# EAGLE design UserInterface_RevA (EAGLE 7.6.0)

## Sheet 1 of 2
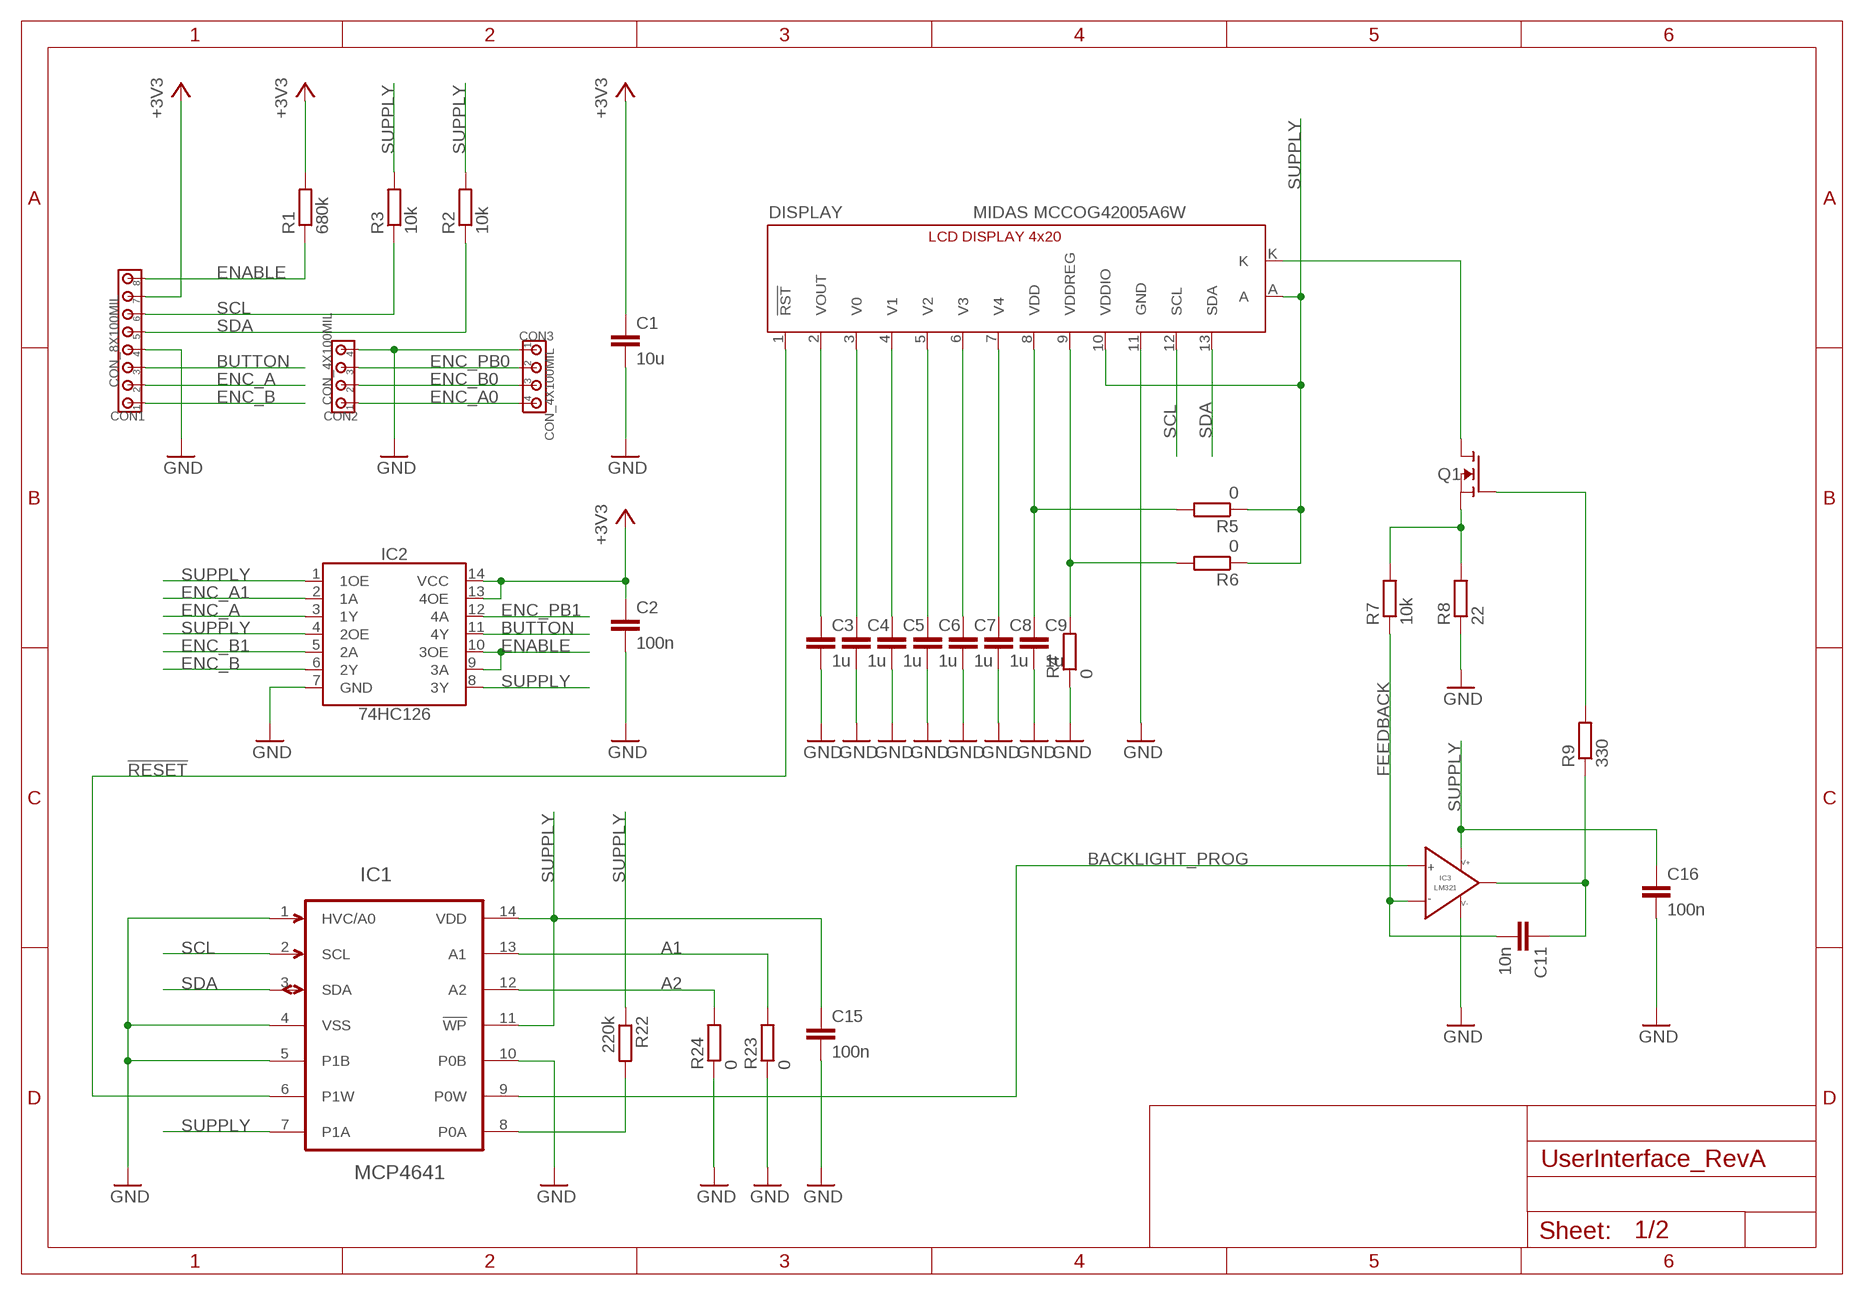
[diagram p0: schematic, sheet 1]

### Parts
C1  10u  CC0805  [C0805]
C2  100n  CC0805  [C0805]
C3  1u  CC0805  [C0805]
C4  1u  CC0805  [C0805]
C5  1u  CC0805  [C0805]
C6  1u  CC0805  [C0805]
C7  1u  CC0805  [C0805]
C8  1u  CC0805  [C0805]
C9  1u  CC0805  [C0805]
C11  10n  CC0805  [C0805]
C15  100n  CC0805  [C0805]
C16  100n  CC0805  [C0805]
CON1  CON_8X100MIL  [100MIL_8X]
CON2  CON_4X100MIL  [100MIL_4X]
CON3  CON_4X100MIL  [100MIL_4X]
DISPLAY  MIDAS MCCOG42005A6W  LCD4X20_I2C  [LCD_4X20_I2C]
IC1  MCP4641  [TSSOP14]
IC2  74HC126  [SO14]
IC3  LM321  [SOT-23-5]
Q1  N-FETSOT23  [SOT23]
R1  680k  RESISTORR0805  [R0805]
R2  10k  RESISTORR0805  [R0805]
R3  10k  RESISTORR0805  [R0805]
R4  0  RESISTORR0805  [R0805]
R5  0  RESISTORR0805  [R0805]
R6  0  RESISTORR0805  [R0805]
R7  10k  RESISTORR0805  [R0805]
R8  22  RESISTORR0805  [R0805]
R9  330  RESISTORR0805  [R0805]
R22  220k  RESISTORR0805  [R0805]
R23  0  RESISTORR0805  [R0805]
R24  0  RESISTORR0805  [R0805]

### Nets
!RESET!: DISPLAY.1(!RST!) IC1.6(P1W)
+3V3: C1.1 C2.1 CON1.7 IC2.13(4OE) IC2.14(VCC) R1.2 ; also sheet 2
A1: IC1.13(A1) R23.2
A2: IC1.12(A2) R24.2
BACKLIGHT_PROG: IC1.9(P0W) IC3.1(IN+)
BUTTON: CON1.3 IC2.11(4Y) ; also sheet 2
ENABLE: CON1.8 IC2.9(3A) IC2.10(3OE) R1.1
ENC_A: CON1.2 IC2.3(1Y) ; also sheet 2
ENC_A0: CON2.1 CON3.4 ; also sheet 2
ENC_A1: IC2.2(1A) ; also sheet 2
ENC_B: CON1.1 IC2.6(2Y) ; also sheet 2
ENC_B0: CON2.2 CON3.3 ; also sheet 2
ENC_B1: IC2.5(2A) ; also sheet 2
ENC_PB0: CON2.3 CON3.2 ; also sheet 2
ENC_PB1: IC2.12(4A) ; also sheet 2
FEEDBACK: C11.2 IC3.3(IN-) R7.1
GATE: Q1.1(G) R9.2
GND: C1.2 C2.2 C3.2 C4.2 C5.2 C6.2 C7.2 C8.2 C9.2 C15.2 C16.2 CON1.4 CON2.4 CON3.1 DISPLAY.11(GND) IC1.1(HVC/A0) IC1.4(VSS) IC1.5(P1B) IC1.10(P0B) IC2.7(GND) IC3.2(V-) R4.1 R8.1 R23.1 R24.1 ; also sheet 2
N$2: DISPLAY.K Q1.3(D)
N$3: C3.1 DISPLAY.2(VOUT)
N$4: C4.1 DISPLAY.3(V0)
N$5: C8.1 DISPLAY.7(V4)
N$6: C7.1 DISPLAY.6(V3)
N$7: C6.1 DISPLAY.5(V2)
N$8: C5.1 DISPLAY.4(V1)
N$17: Q1.2(S) R7.2 R8.2
N$19: IC1.8(P0A) R22.2
OPAMP_OUT: C11.1 IC3.4(VOUT) R9.1
SCL: CON1.6 DISPLAY.12(SCL) IC1.2(SCL) R3.1
SDA: CON1.5 DISPLAY.13(SDA) IC1.3(SDA) R2.1
SUPPLY: C15.1 C16.1 DISPLAY.10(VDDIO) DISPLAY.A IC1.7(P1A) IC1.11(!WP!) IC1.14(VDD) IC2.1(1OE) IC2.4(2OE) IC2.8(3Y) IC3.5(V+) R2.2 R3.2 R5.1 R6.1 R22.1 ; also sheet 2
VDD: C9.1 DISPLAY.8(VDD) R5.2
VDREG: DISPLAY.9(VDDREG) R4.2 R6.2

## Sheet 2 of 2
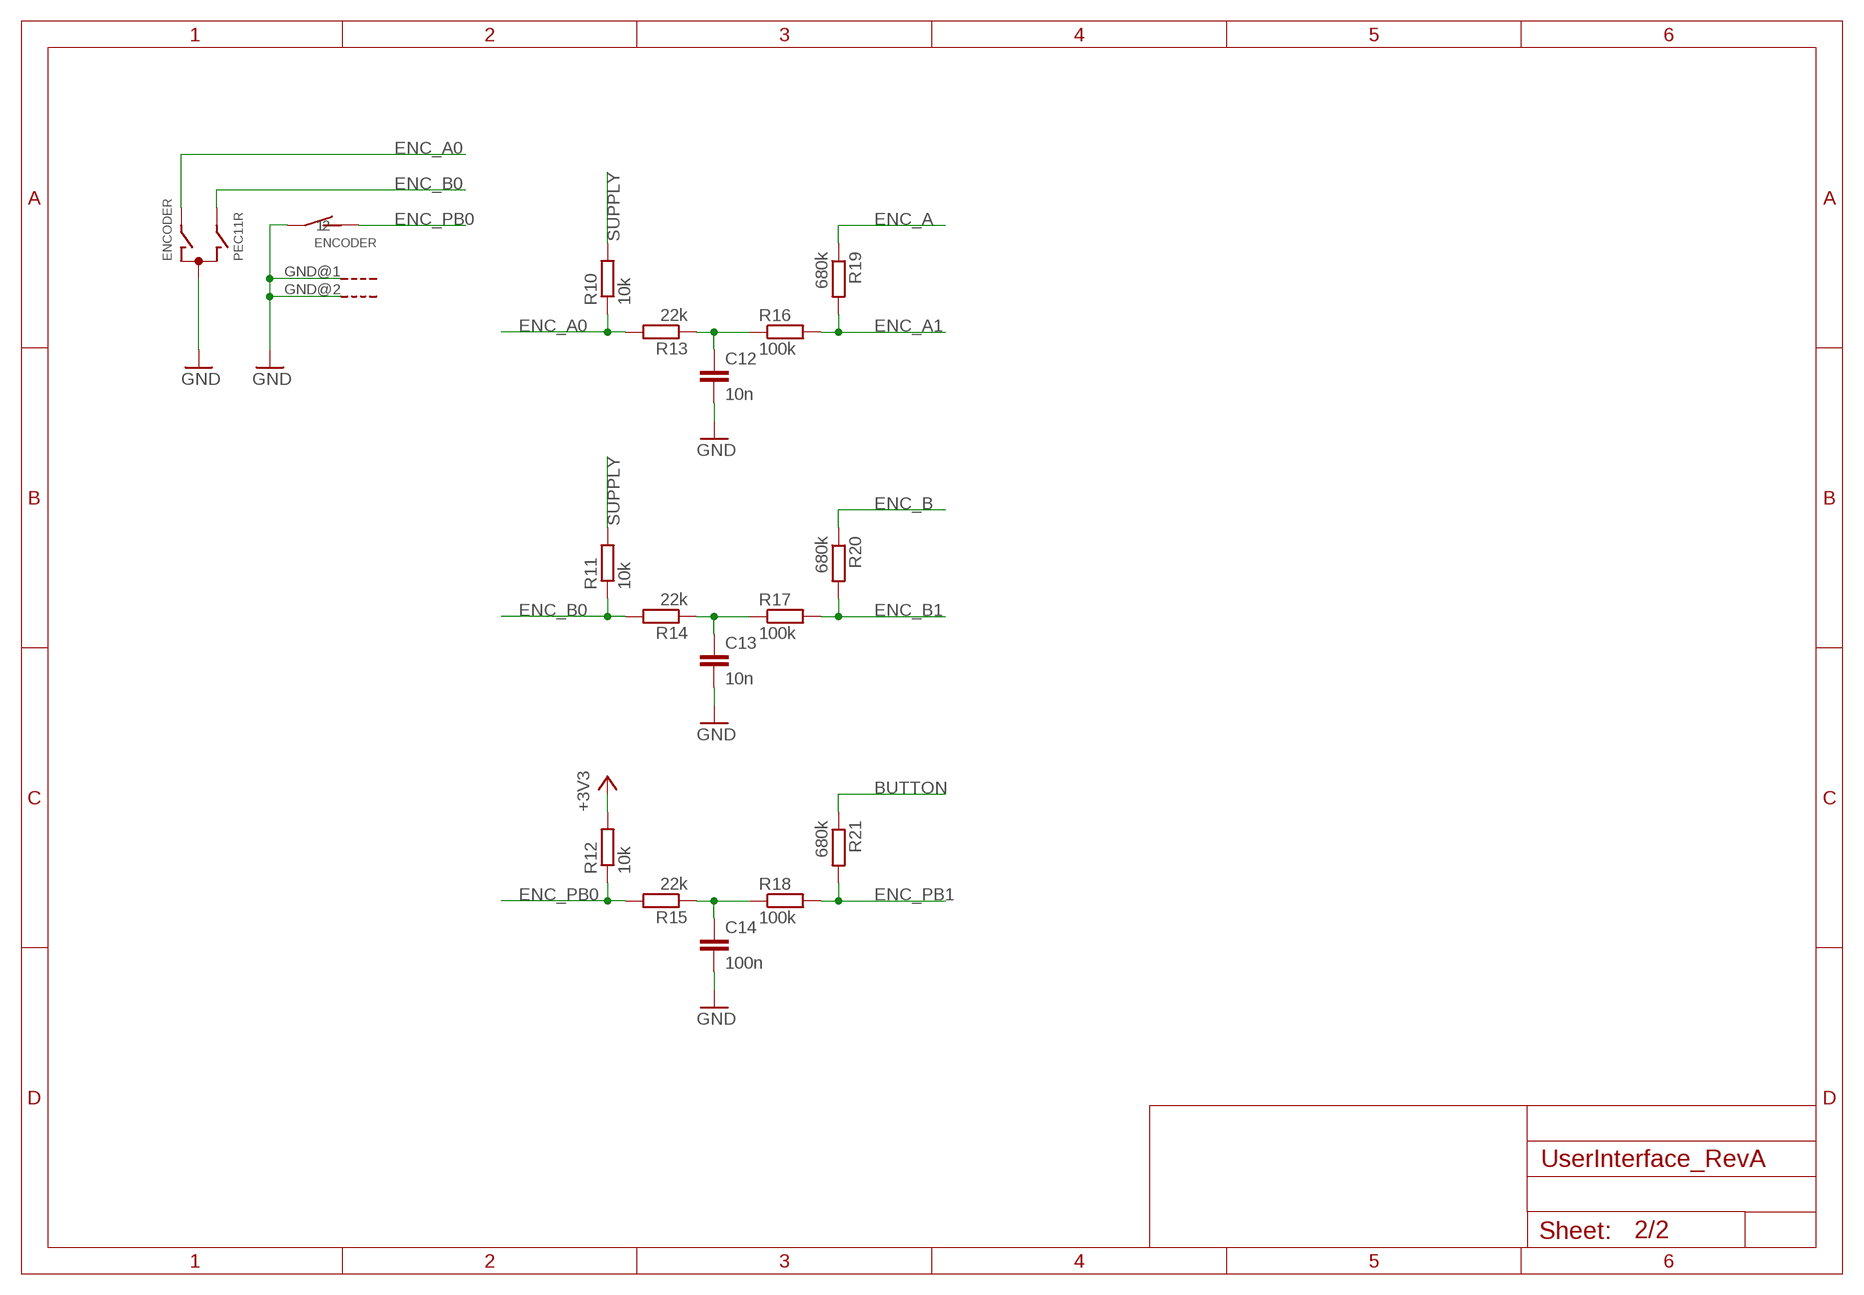
[diagram p1: schematic, sheet 2]

### Parts
C12  10n  CC0805  [C0805]
C13  10n  CC0805  [C0805]
C14  100n  CC0805  [C0805]
ENCODER  PEC11R  ENCODER_BOURNS  [ENCODER_BOURNS]
R10  10k  RESISTORR0805  [R0805]
R11  10k  RESISTORR0805  [R0805]
R12  10k  RESISTORR0805  [R0805]
R13  22k  RESISTORR0805  [R0805]
R14  22k  RESISTORR0805  [R0805]
R15  22k  RESISTORR0805  [R0805]
R16  100k  RESISTORR0805  [R0805]
R17  100k  RESISTORR0805  [R0805]
R18  100k  RESISTORR0805  [R0805]
R19  680k  RESISTORR0805  [R0805]
R20  680k  RESISTORR0805  [R0805]
R21  680k  RESISTORR0805  [R0805]

### Nets
+3V3: R12.2 ; also sheet 1
BUTTON: R21.1 ; also sheet 1
ENC_A: R19.1 ; also sheet 1
ENC_A0: ENCODER.A R10.1 R13.2 ; also sheet 1
ENC_A1: R16.2 R19.2 ; also sheet 1
ENC_B: R20.1 ; also sheet 1
ENC_B0: ENCODER.B R11.1 R14.2 ; also sheet 1
ENC_B1: R17.2 R20.2 ; also sheet 1
ENC_PB0: ENCODER.1 R12.1 R15.2 ; also sheet 1
ENC_PB1: R18.2 R21.2 ; also sheet 1
GND: C12.2 C13.2 C14.2 ENCODER.2 ENCODER.C ENCODER.GND@1(G) ENCODER.GND@2(G) ; also sheet 1
N$9: C13.1 R14.1 R17.1
N$12: C12.1 R13.1 R16.1
N$13: C14.1 R15.1 R18.1
SUPPLY: R10.2 R11.2 ; also sheet 1

## Library data of the parts
C1-C9 C11-C16 = 00Capacitor:C: Capacitor
CON1 = 00Connector:CON_8X: 8-pin header
CON2 CON3 = 00Connector:CON_4X: 4-pin header
DISPLAY = 00Display:LCD4X20_I2C: 4x20 character LCD display with I2C interface
ENCODER = 00Switch:ENCODER_BOURNS: Bourns Rotary Encoder with Switch PEC11-4xxxF-Sxxxx
IC1 = 00DigiPot:MCP4641: Dual DigiPot with 128 steps and non-volatile memory
IC2 = 00Logic:74HC126: Quad buffer/line driver; 3-state
IC3 = 00OpAmp:LM321: LM321 Low Power Single Operational Amplifier 3-32V
Q1 = 00Mosfet:N-FET: N-Channel MOSFET
R1-R24 = 00Resistor:RESISTOR: RESISTOR, European symbol

## Board
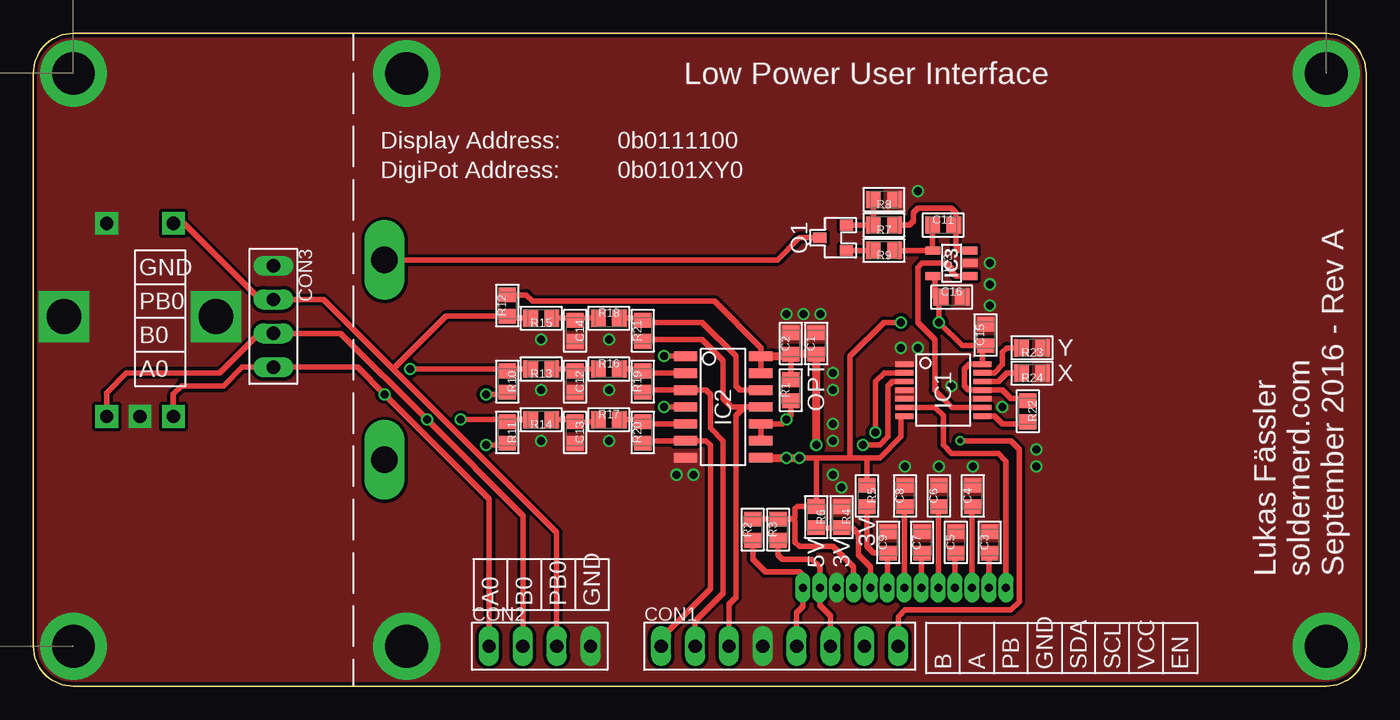
[diagram p2: board, top side]
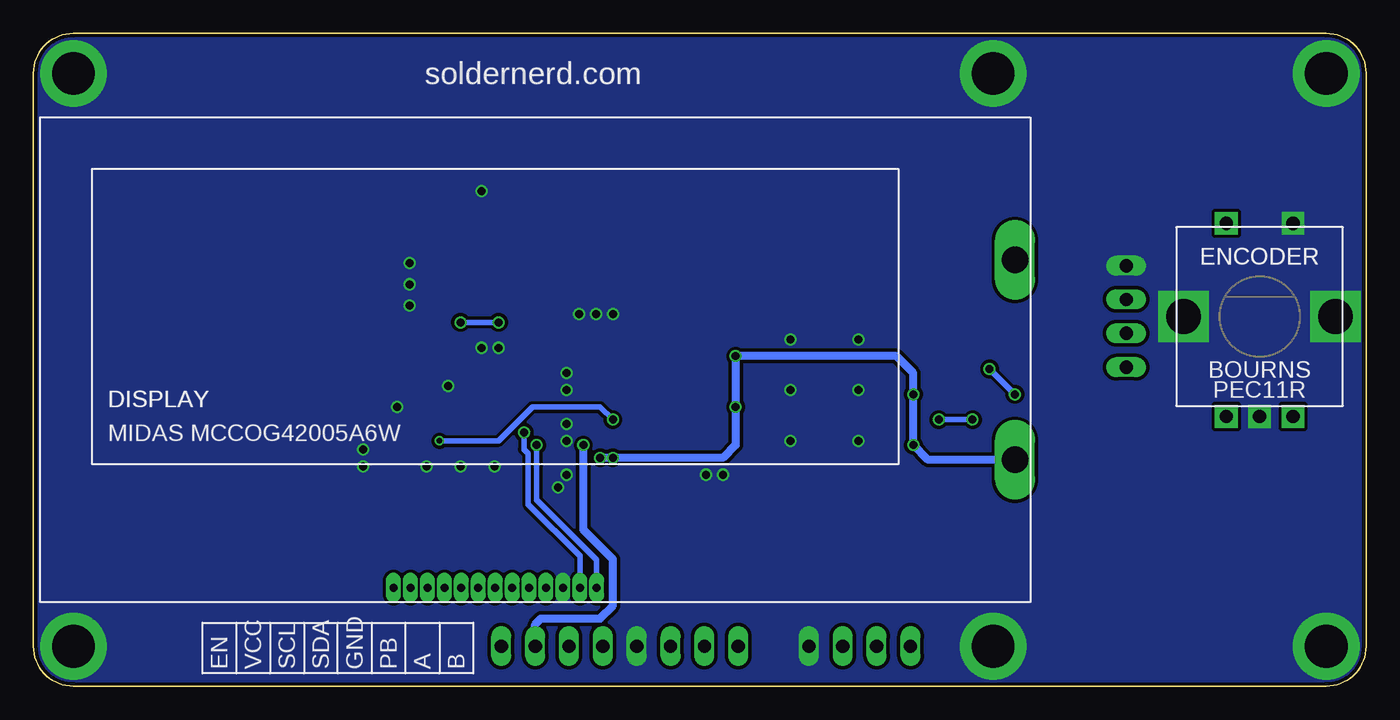
[diagram p3: board, bottom side, seen from below]

Size 100 x 49 mm. Coordinates in mm from the lower left corner, seen from the top.
Outline: 0,3 0,46 arc-90 3,49 97,49 arc-90 100,46 100,3 arc-90 97,0 3,0 arc-90 0,3
Copper layers (1*16): Top 0.035mm / dielectric 1.5mm / Bottom 0.035mm
Design rules "dirt_cheap_dirty_boards.v1": minimum track width 5mil, minimum drill 12mil, track to track 5mil, track to pad 5mil, pad to pad 5mil, via to via 5mil, smd to smd 0mil, copper to edge 10mil, drill to drill 10mil, minimum pad ring 10mil, minimum via ring 6mil, stop-mask expansion 2mil, vias tented up to drill 25mil, thermal gap 10mil

### Footprints (pad centres in the part's own frame; a part is rotated, then mirrored left to right if it is on the bottom)
C0805 = smd 1.1 x 1.3: 1 -0.8,0; 2 0.8,0
100MIL_8X = drill 1 long: 1 -8.89,0; 2 -6.35,0; 3 -3.81,0; 4 -1.27,0; 5 1.27,0; 6 3.81,0; 7 6.35,0; 8 8.89,0
100MIL_4X = drill 1 long: 1 -3.81,0; 2 -1.27,0; 3 1.27,0; 4 3.81,0
LCD_4X20_I2C = drill 0.6 pad 1 long: 1 26.53,1.1; 2 27.8,1.1; 3 29.07,1.1; 4 30.34,1.1; 5 31.61,1.1; 6 32.88,1.1; 7 34.15,1.1; 8 35.42,1.1; 9 36.69,1.1; 10 37.96,1.1; 11 39.23,1.1; 12 40.5,1.1; 13 41.77,1.1 | drill 2 long: A 73.15,10.7; K 73.15,25.7
ENCODER_BOURNS = drill 1 pad 1.7 square: 1 -2.5,7; 2 2.5,7; A -2.5,-7.5; B 2.5,-7.5; C 0,-7.5 | drill 2.6 pad 3.8 square: GND@1 -5.7,0; GND@2 5.7,0
TSSOP14 = smd 0.4 x 1.35: 1 -1.95,-2.925; 2 -1.3,-2.925; 3 -0.65,-2.925; 4 0,-2.925; 5 0.65,-2.925; 6 1.3,-2.925; 7 1.95,-2.925; 8 1.95,2.925; 9 1.3,2.925; 10 0.65,2.925; 11 0,2.925; 12 -0.65,2.925; 13 -1.3,2.925; 14 -1.95,2.925
SO14 = smd 0.7 x 1.75: 1 -3.81,-2.825; 2 -2.54,-2.825; 3 -1.27,-2.825; 4 0,-2.825; 5 1.27,-2.825; 6 2.54,-2.825; 7 3.81,-2.825; 8 3.81,2.825; 9 2.54,2.825; 10 1.27,2.825; 11 0,2.825; 12 -1.27,2.825; 13 -2.54,2.825; 14 -3.81,2.825
SOT-23-5 = smd 0.6 x 1.1: 1 -0.95,-1.4; 2 0,-1.4; 3 0.95,-1.4; 4 0.95,1.4; 5 -0.95,1.4
SOT23 = smd 0.8 x 1: 1 -0.95,-1; 2 0.95,-1; 3 0,1
R0805 = smd 1.1 x 1.3: 1 -0.8,0; 2 0.8,0

### Placement (x,y rotation side)
C1  58.74,25.72 90 top
C2  56.83,25.72 90 top
C3  71.75,10.79 90 top
C4  70.48,14.29 90 top
C5  69.22,10.79 90 top
C6  67.94,14.29 90 top
C7  66.67,10.79 90 top
C8  65.41,14.29 90 top
C9  64.14,10.79 90 top
C11  68.26,34.61 0 top
C12  40.64,22.86 270 top
C13  40.64,19.05 270 top
C14  40.64,26.67 270 top
C15  71.44,26.35 90 top
C16  68.9,29.21 0 top
CON1  56,3 0 top
CON2  38,3 0 top
CON3  18,27.75 270 top
DISPLAY  99.5,6.3 0 bottom
ENCODER  8,27.75 0 bottom
IC1  68.26,22.23 270 top
IC2  51.75,20.95 270 top
IC3  68.9,31.75 90 top
Q1  60.01,33.66 90 top
R1  56.83,22.23 90 top
R2  53.98,11.75 90 top
R3  55.88,11.75 90 top
R4  60.64,12.7 270 top
R5  62.55,14.29 270 top
R6  58.74,12.7 270 top
R7  63.82,34.61 180 top
R8  63.82,36.51 180 top
R9  63.82,32.7 180 top
R10  35.56,22.86 270 top
R11  35.56,19.05 270 top
R12  35.56,28.57 90 top
R13  38.1,23.81 180 top
R14  38.1,20 180 top
R15  38.1,27.62 180 top
R16  43.18,23.81 0 top
R17  43.18,20 0 top
R18  43.18,27.62 0 top
R19  45.72,22.86 90 top
R20  45.72,19.05 90 top
R21  45.72,26.67 90 top
R22  74.61,20.64 270 top
R23  74.93,25.4 180 top
R24  74.93,23.5 180 top

### Tracks (layer width: path | path; a pad name or v marks a point on that pad's centre or on a via)
!RESET!
  Top 0.406: IC1.6 67.66,20.93 68.26,20.32 68.26,18.1 68.9,17.46 72.39,17.46 72.97,16.88 DISPLAY.1
+3V3  (via drill 0.6)
  Top 0.406: R12.2 36.98,29.38 37.47,28.89 51.12,28.89 54.61,25.4 54.61,24.8 IC2.14 IC2.13 | R1.2 C2.1
  Top 0.61: v58.74,18.1 C1.1 C2.1 56.71,24.8 54.61,24.8
  Bottom 0.61: CON1.7 62.35,4.64 61.91,5.08 57.47,5.08 56.52,6.03 56.52,9.53 58.74,11.75 v58.74,18.1
A1
  Top 0.406: IC1.13 72.1,23.52 72.71,24.13 72.71,25.08 73.03,25.4 R23.2
A2
  Top 0.406: IC1.12 72.41,22.88 73.03,23.5 R24.2
BACKLIGHT_PROG
  Top 0.406: IC3.1 69.21,30.8 68.9,31.11 68.9,31.43 68.58,31.75 66.67,31.75 66.36,31.43 66.36,27.3 67.63,26.04 67.63,22.23 68.93,20.93 IC1.9
BUTTON
  Top 0.406: IC2.11 53.34,20.95 | 53.34,20.95 52.39,20.95 51.75,21.59 51.75,24.45 50.16,26.04 45.88,26.04 R21.1 | 53.34,20.95 52.7,20.32 52.7,6.67 52.19,6.15 CON1.3
ENABLE  (via drill 0.4, 0.6)
  Top 0.406: R1.1 56.83,20.32 v56.52,20 56.2,19.68 IC2.10 IC2.9 | CON1.8 64.89,5.2 65.41,5.71 73.34,5.71 73.98,6.35 73.98,17.78 73.34,18.41 v69.53,18.41
  Bottom 0.406: v69.53,18.41 65.09,18.41 62.55,20.95 57.47,20.95 v56.52,20
ENC_A
  Top 0.406: CON1.2 49.65,4.88 51.75,6.99 51.75,18.41 50.8,19.37 50.8,21.91 50.48,22.23 IC2.3 45.88,22.23 R19.1
ENC_A0  (via drill 0.6)
  Top 0.406: ENCODER.A 10.5,21.93 11.11,22.54 14.29,22.54 15.69,23.94 CON3.4 24.32,23.94 v26.35,21.91 34.19,14.07 CON2.1 | v28.26,23.81 35.41,23.81 R10.1 35.71,23.81 R13.2
  Bottom 0.406: v28.26,23.81 v26.35,21.91
ENC_A1
  Top 0.406: R16.2 45.57,23.81 R19.2 45.88,23.5 IC2.2
ENC_B
  Top 0.406: CON1.1 47.11,3.61 50.8,7.3 50.8,18.1 50.48,18.41 IC2.6 45.88,18.41 R20.1
ENC_B0  (via drill 0.6)
  Top 0.406: ENCODER.B 5.5,22.01 6.99,23.5 13.97,23.5 16.95,26.48 CON3.3 23.05,26.48 v29.53,20 36.73,12.8 CON2.2 | v32.07,20 35.41,20 R11.1 35.71,20 R14.2
  Bottom 0.406: v32.07,20 v29.53,20
ENC_B1
  Top 0.406: R17.2 45.57,20 R20.2 45.88,19.68 IC2.5
ENC_PB0
  Top 0.406: 26.99,23.81 21.78,29.02 CON3.2 17.02,29.02 11.29,34.75 ENCODER.1 | 26.99,23.81 39.27,11.53 CON2.3 | R15.2 35.71,27.62 R12.1 30.95,27.77 26.99,23.81
ENC_PB1
  Top 0.406: IC2.12 53.02,22.23 52.7,22.54 52.7,24.77 50.16,27.3 45.88,27.3 R21.2 45.57,27.62 R18.2
FEEDBACK
  Top 0.406: R7.1 65.72,34.61 66.04,34.92 66.04,35.56 66.36,35.88 68.9,35.88 69.22,35.56 69.22,34.76 C11.2 69.22,34.45 69.22,33.02 69.53,32.7 IC3.3
GATE
  Top 0.406: Q1.1 R9.2
GND  (via drill 0.6, 3.2 pad 5)
  other vias: 3,46 28,46 28,3 3,3 97,3 97,46 38.1,26.04 43.18,26.04 43.18,22.23 38.1,22.23 38.1,18.41 43.18,18.41 60.01,15.88 60.64,14.92 66.36,37.15 71.75,28.57 71.75,31.75 71.75,30.16 65.09,25.4 66.36,25.4 68.9,22.54 72.71,20.95 49.53,15.88 48.26,15.88 65.41,16.51 67.94,16.51 70.48,16.51 56.52,27.94 57.78,27.94 59.05,27.94 60.01,18.41 60.01,19.68 60.01,23.5 60.01,22.23 75.25,17.78 75.25,16.51
  pour Bottom (isolate 0.25, no thermals): 3,49 97,49 arc-90 100,46 100,3 arc-90 97,0 3,0 arc-90 0,3 0,46 arc-90
  pour Top (isolate 0.25, no thermals): 3,49 97,49 arc-90 100,46 100,3 arc-90 97,0 3,0 arc-90 0,3 0,46 arc-90
N$2
  Top 0.406: Q1.3 57.47,33.66 55.81,32 DISPLAY.K
N$3
  Top 0.406: DISPLAY.2 71.7,9.94 C3.1
N$4
  Top 0.406: DISPLAY.3 70.43,13.43 C4.1
N$5
  Top 0.406: DISPLAY.7 65.35,13.43 C8.1
N$6
  Top 0.406: DISPLAY.6 66.62,9.94 C7.1
N$7
  Top 0.406: DISPLAY.5 67.89,13.43 C6.1
N$8
  Top 0.406: DISPLAY.4 69.16,9.94 C5.1
N$9
  Top 0.406: R14.1 40.49,20 C13.1 42.23,19.85 R17.1
N$12
  Top 0.406: R16.1 40.79,23.81 C12.1 40.49,23.81 R13.1
N$13
  Top 0.406: R15.1 40.49,27.62 C14.1 40.79,27.62 R18.1
N$17
  Top 0.406: R8.2 R7.2 Q1.2
N$19
  Top 0.406: IC1.8 72.12,20.27 72.71,19.68 74.46,19.68 R22.2
OPAMP_OUT
  Top 0.406: C11.1 67.46,32.73 IC3.4 R9.1
SCL  (via drill 0.6)
  Top 0.406: R3.1 55.88,9.84 56.2,9.53 58.42,9.53 59,8.95 DISPLAY.12 59,6.09 59.81,5.28 CON1.6 | IC1.2 63.85,23.52 63.18,22.86 v63.18,19.05
  Bottom 0.406: v63.18,19.05 63.18,17.78 62.87,17.46 62.87,13.65 59,9.79 DISPLAY.12
SDA  (via drill 0.6)
  Top 0.406: R2.1 53.98,9.53 54.93,8.57 57.47,8.57 57.73,8.31 DISPLAY.13 57.73,5.98 57.27,5.52 CON1.5 | IC1.3 64.47,22.88 64.14,22.54 64.14,18.73 63.5,18.1 v62.23,18.1
  Bottom 0.406: v62.23,18.1 62.23,13.97 57.73,9.47 DISPLAY.13
SUPPLY  (via drill 0.6)
  Top 0.406: IC2.1 v47.31,24.77 | IC2.4 v47.31,20.95 | v33.98,21.91 v33.97,21.91 35.41,21.91 R10.2 | v33.97,18.1 v33.98,18.1 35.41,18.1 R11.2 | IC3.5 67.63,30.67 67.63,29.21 C16.1 67.94,29.21 v67.94,27.3 69.7,25.55 C15.1 71.19,25.3 IC1.14 70.21,24.18 69.85,23.81 69.85,22.54 70.17,22.23 IC1.11 72.71,22.23 73.34,21.59 74.46,21.59 R22.1 | R5.1 62.55,17.14 | 62.55,17.14 61.28,17.14 | 61.28,17.14 58.74,17.14 | 58.74,17.14 v57.47,17.14 | 58.74,17.14 R6.1 57.31,13.5 57.15,13.34 57.15,12.71 56.98,12.55 | DISPLAY.10 61.54,8.95 60.01,10.48 57.47,10.48 57.15,10.79 57.15,12.38 56.98,12.55 | R2.2 R3.2 56.98,12.55 | 61.28,17.14 61.28,24.77 63.82,27.3 v65.09,27.3 | 62.55,17.14 63.5,17.14 65.09,18.73 65.09,20.27 IC1.7
  Top 0.61: IC2.8 v56.52,17.14 v57.47,17.14
  Bottom 0.406: v65.09,27.3 v67.94,27.3 v67.95,27.3
  Bottom 0.61: DISPLAY.A 32.88,17 v33.97,18.1 v33.97,21.91 33.97,23.5 35.24,24.77 v47.31,24.77 v47.31,20.95 47.31,18.1 48.26,17.14 v56.52,17.14 v57.47,17.14
VDD
  Top 0.406: DISPLAY.8 64.08,9.94 C9.1 63.03,9.99 62.55,10.48 R5.2
VDREG
  Top 0.406: DISPLAY.9 62.81,8.95 61.91,9.84 61.91,11.43 61.44,11.9 R4.2 R6.2

### Text on the board
tPlace: Low Power User Interface | Display Address: | 0b0111100 | DigiPot Address: | 0b0101XY0 | GND | PB0 | B0 | Y | A0 | X | OPT | 3V | 5V | 3V | Lukas Fässler | soldernerd.com | September 2016 - Rev A | A0 | B0 | PB0 | GND | B | A | PB | GND | SDA | SCL | VCC | EN
bPlace: soldernerd.com | B | A | PB | GND | SDA | SCL | VCC | EN